# EasyEDA schematic SCH_Star blinking_2021-12-23.json
TITLE: Sheet_1; REV: 1.0; Date: 2021-12-14; Sheet: 1/1; Drawn By: limchengwei; Company: Your Company
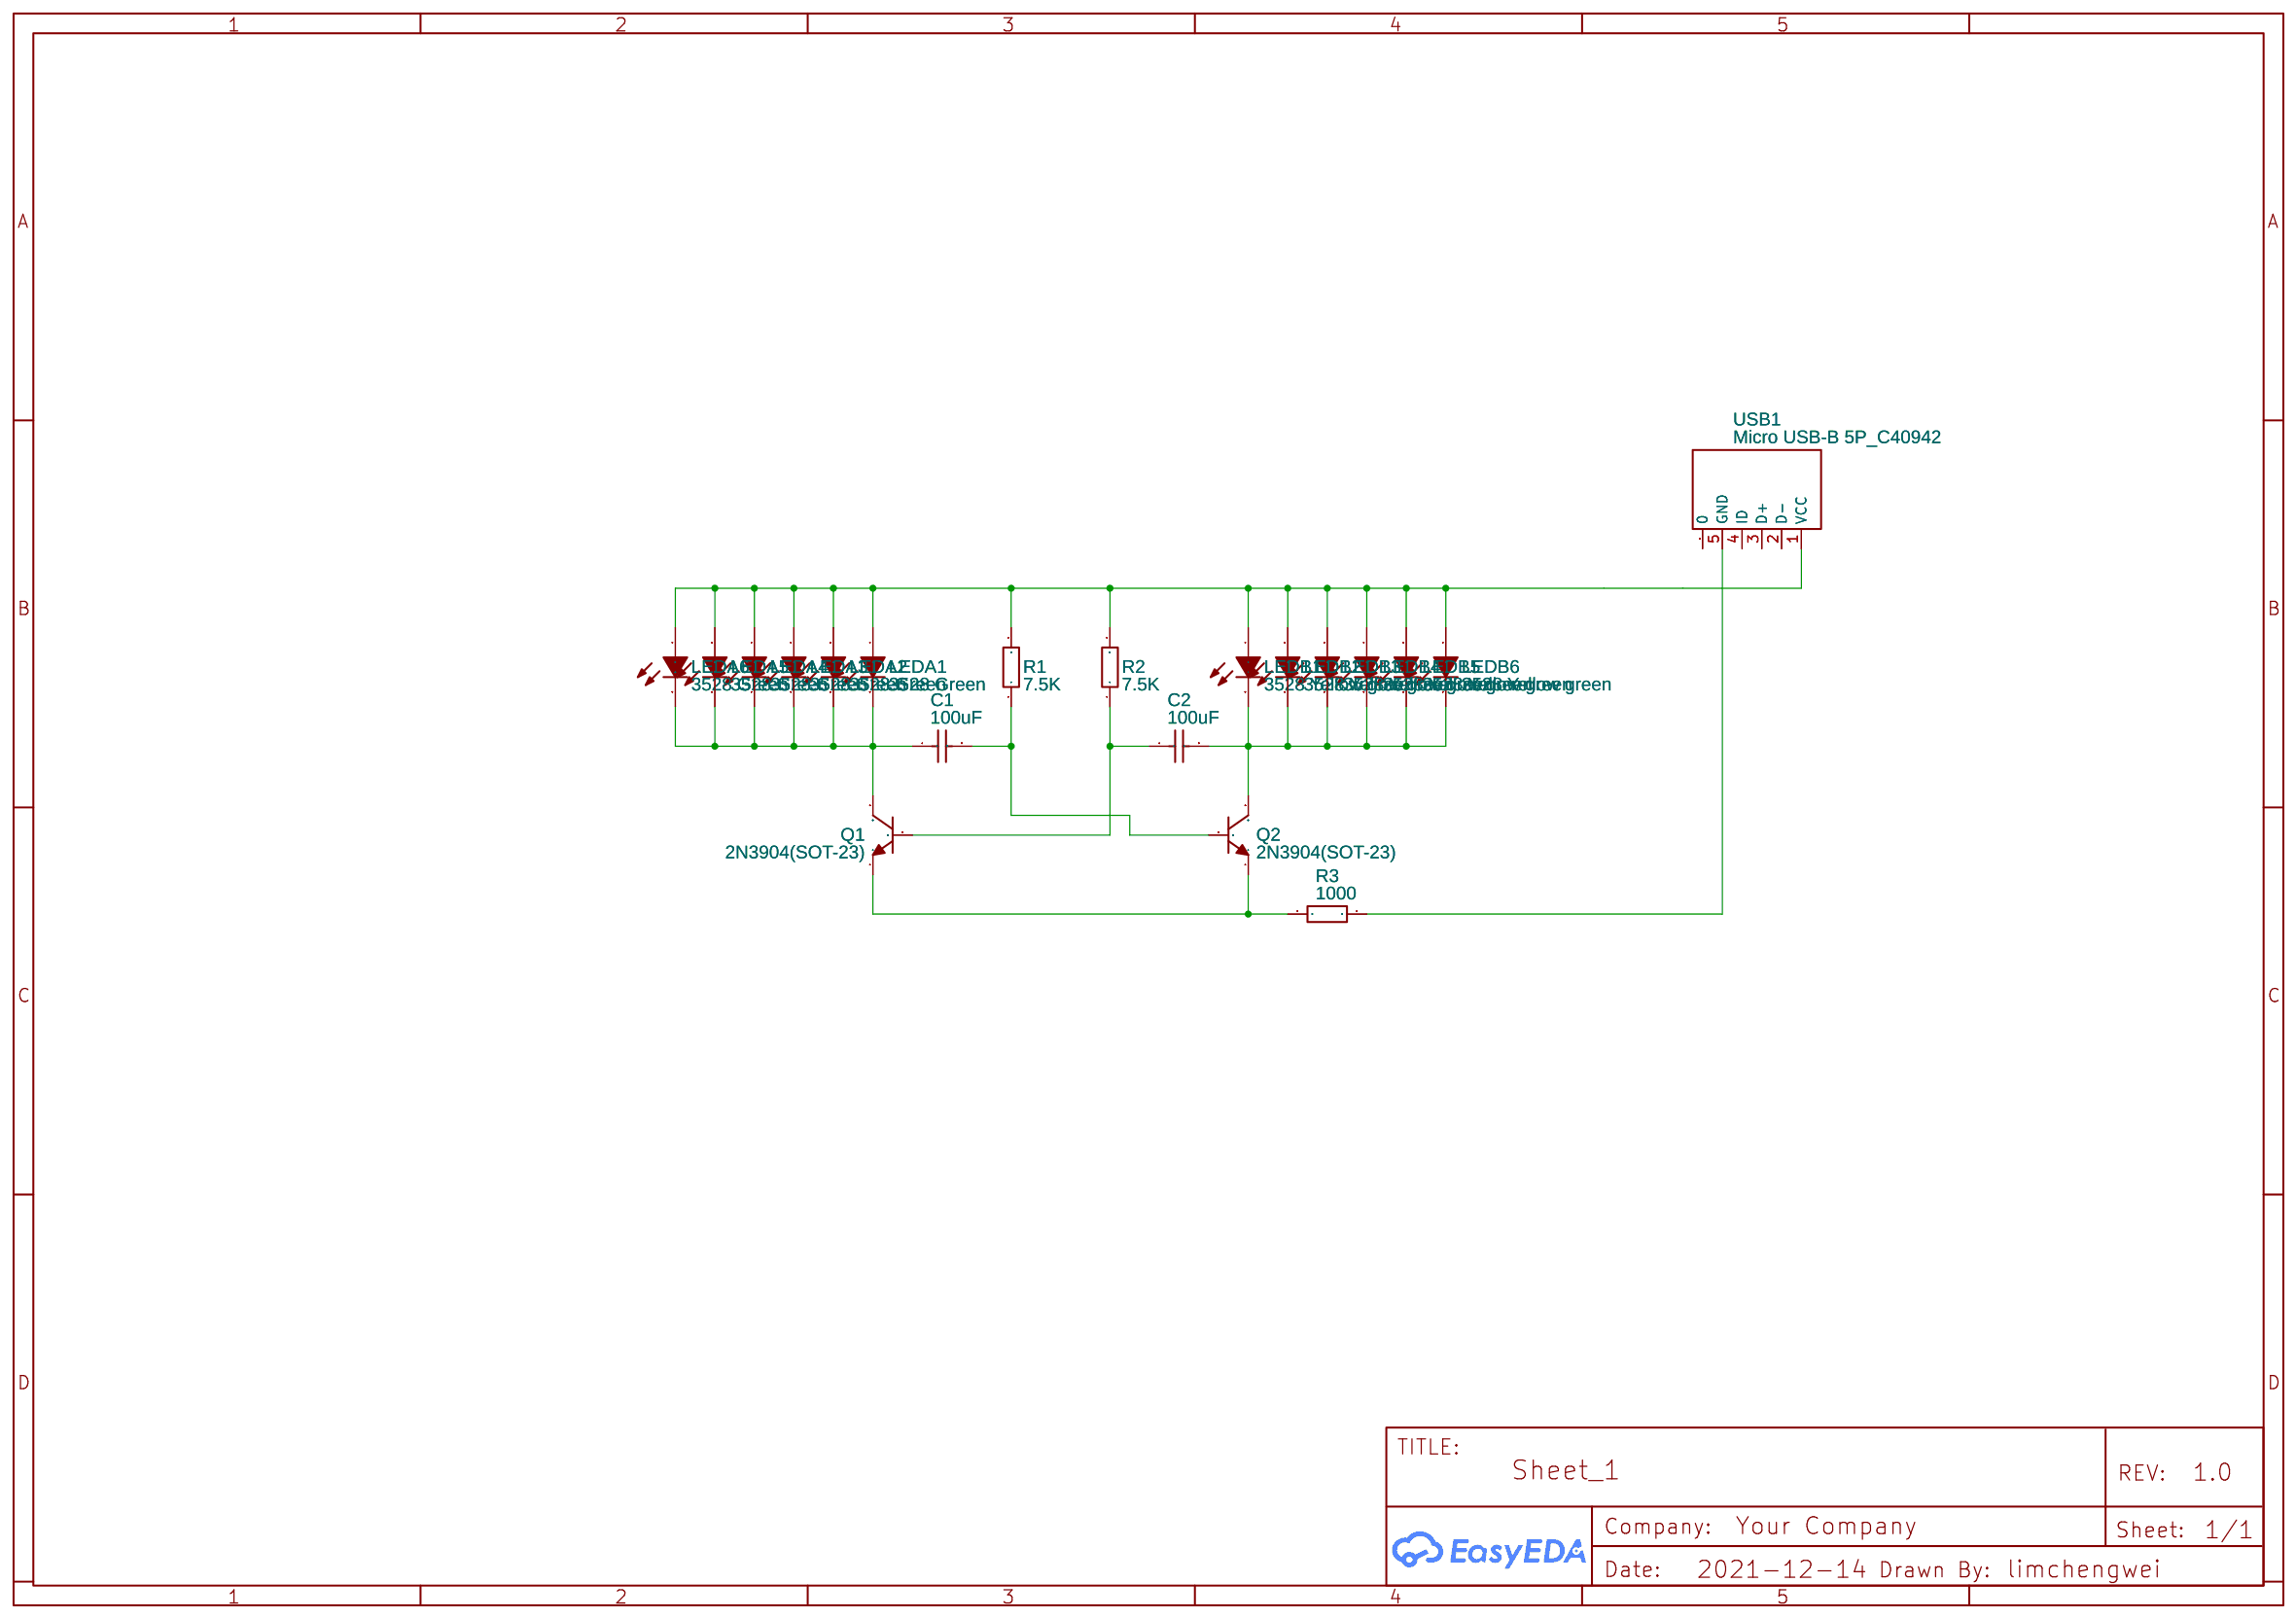
[diagram p0: schematic sheet]

## Parts
C1  100uF  [C1210]
C2  100uF  [C1210]
LEDA1  3528 Green  [LED-SMD_L3.5-W2.8-R-RD]
LEDA2  3528 Green  [LED-SMD_L3.5-W2.8-R-RD]
LEDA3  3528 Green  [LED-SMD_L3.5-W2.8-R-RD]
LEDA4  3528 Green  [LED-SMD_L3.5-W2.8-R-RD]
LEDA5  3528 Green  [LED-SMD_L3.5-W2.8-R-RD]
LEDA6  3528 Green  [LED-SMD_L3.5-W2.8-R-RD]
LEDB1  3528 Yellow green  [LED-SMD_L3.5-W2.8-R-RD]
LEDB2  3528 Yellow green  [LED-SMD_L3.5-W2.8-R-RD]
LEDB3  3528 Yellow green  [LED-SMD_L3.5-W2.8-R-RD]
LEDB4  3528 Yellow green  [LED-SMD_L3.5-W2.8-R-RD]
LEDB5  3528 Yellow green  [LED-SMD_L3.5-W2.8-R-RD]
LEDB6  3528 Yellow green  [LED-SMD_L3.5-W2.8-R-RD]
Q1  2N3904(SOT-23)  [SOT-23-3_L2.9-W1.3-P1.90-LS2.4-TR]
Q2  2N3904(SOT-23)  [SOT-23-3_L2.9-W1.3-P1.90-LS2.4-TR]
R1  7.5K  [R1210]
R2  7.5K  [R1210]
R3  1000  [R1210]
USB1  Micro USB-B 5P_C40942  [MICRO-USB-SMD_5P-P0.65-H-M_MICRO-USB-5P]

## Library data of the parts
C1 C2 = CL32A107MQVNNNE: Supplier: LCSC; Manufacturer: SAMSUNG; Supplier Part: C49066; JLCPCB Part Class: Extended Part
LEDA1-LEDA6 = 3528 Green: Supplier Part: C2308; Supplier: LCSC; Manufacturer: KENTO; JLCPCB Part Class: Extended Part
LEDB1-LEDB6 = 3528 Yellow green: Supplier: LCSC; Manufacturer: KENTO; Supplier Part: C2304; JLCPCB Part Class: Extended Part
Q1 Q2 = 2N3904(SOT-23): Supplier: LCSC; Manufacturer: KEC; Manufacturer Part: 2n3904S-RTK/PS; Supplier Part: C18536; Paste Type: SOT-23; Contributor: LCEDA_Lib
R1-R3 = 1210W3J0752T5E: Supplier: LCSC; Manufacturer: UniOhm; Supplier Part: C26065; JLCPCB Part Class: Extended Part
USB1 = Micro USB-B 5P_C40942: Supplier: LCSC; Manufacturer: ValuePro; Supplier Part: C40942; JLCPCB Part Class: Extended Part

## Nets
Net-(C1-1): C1.1 LEDA1.2(C) LEDA2.2(C) LEDA3.2(C) LEDA4.2(C) LEDA5.2(C) LEDA6.2(C) Q1.3(C)
Net-(C1-2): C1.2 Q2.2(B) R1.1
Net-(C2-1): C2.1 Q1.2(B) R2.1
Net-(C2-2): C2.2 LEDB1.2(-) LEDB2.2(-) LEDB3.2(-) LEDB4.2(-) LEDB5.2(-) LEDB6.2(-) Q2.3(C)
Net-(LEDA1-1): LEDA1.1(A) LEDA2.1(A) LEDA3.1(A) LEDA4.1(A) LEDA5.1(A) LEDA6.1(A) LEDB1.1(+) LEDB2.1(+) LEDB3.1(+) LEDB4.1(+) LEDB5.1(+) LEDB6.1(+) R1.2 R2.2 USB1.1(VCC)
Net-(Q1-1): Q1.1(E) Q2.1(E) R3.2
Net-(R3-1): R3.1 USB1.5(GND)

Not connected (* = marked no-connect by the designer): USB1 0 2(D-) 3(D+) 4(ID)
